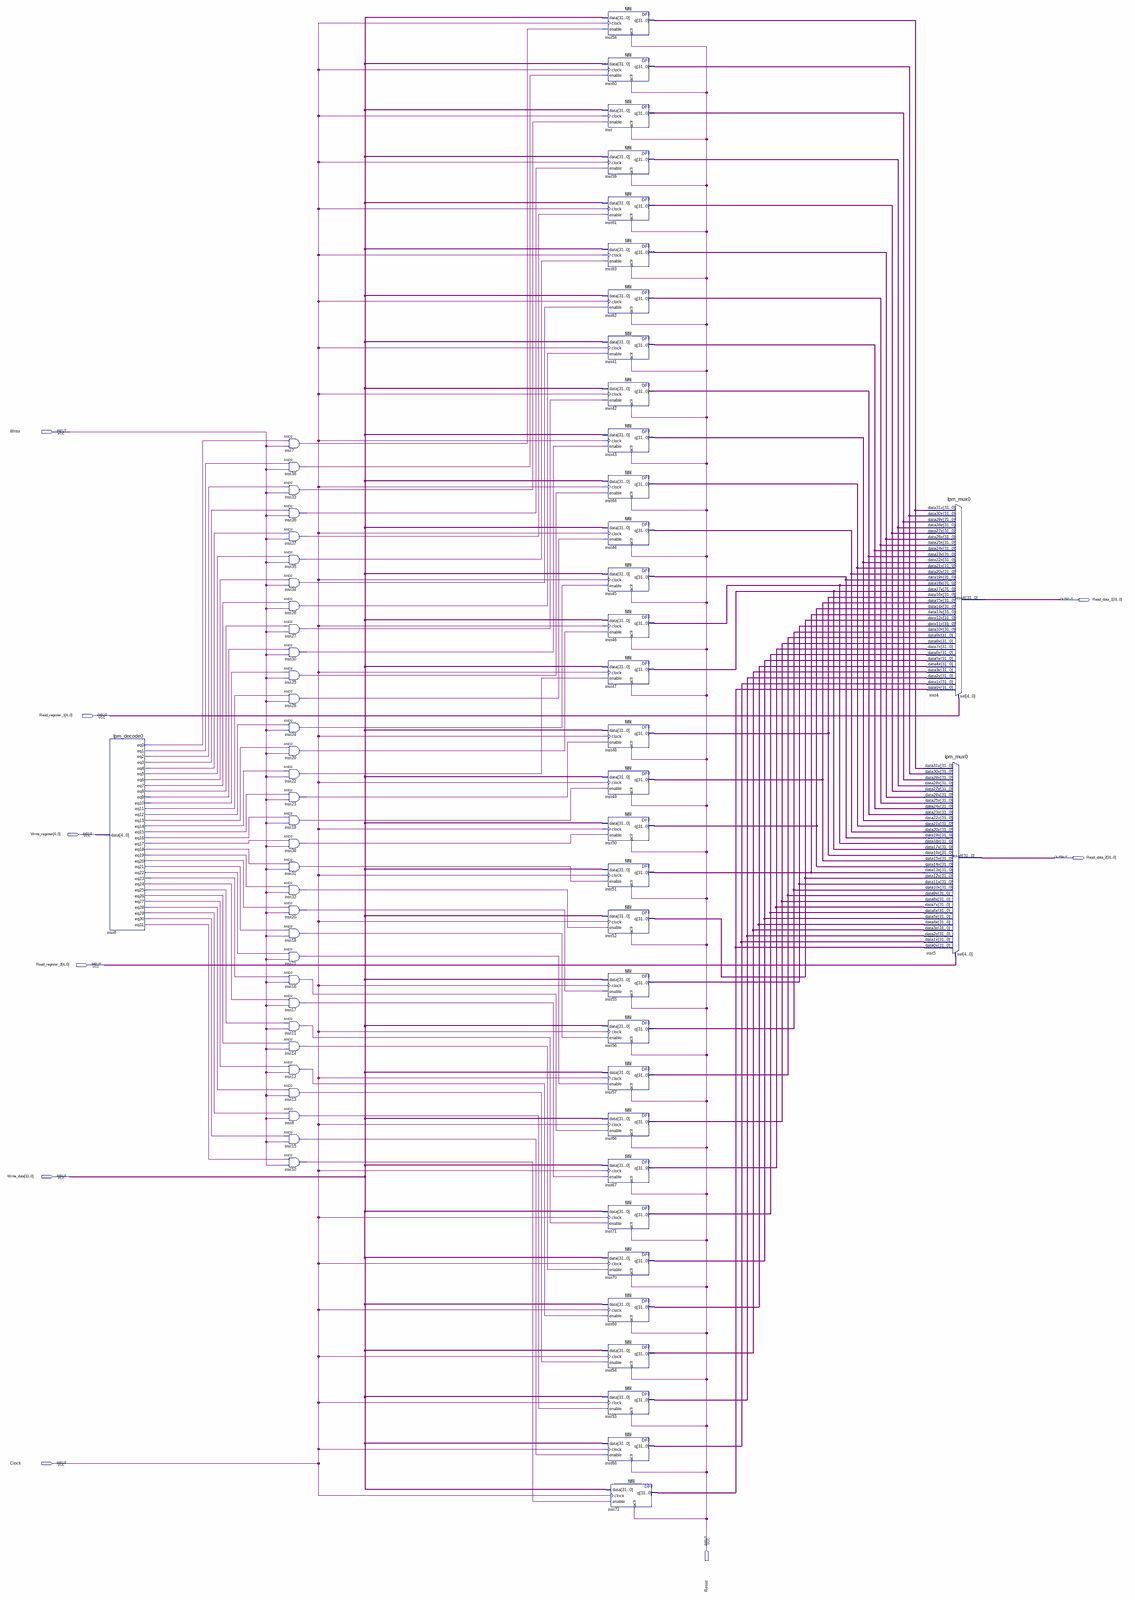
[diagram p0: schematic sheet, whole]
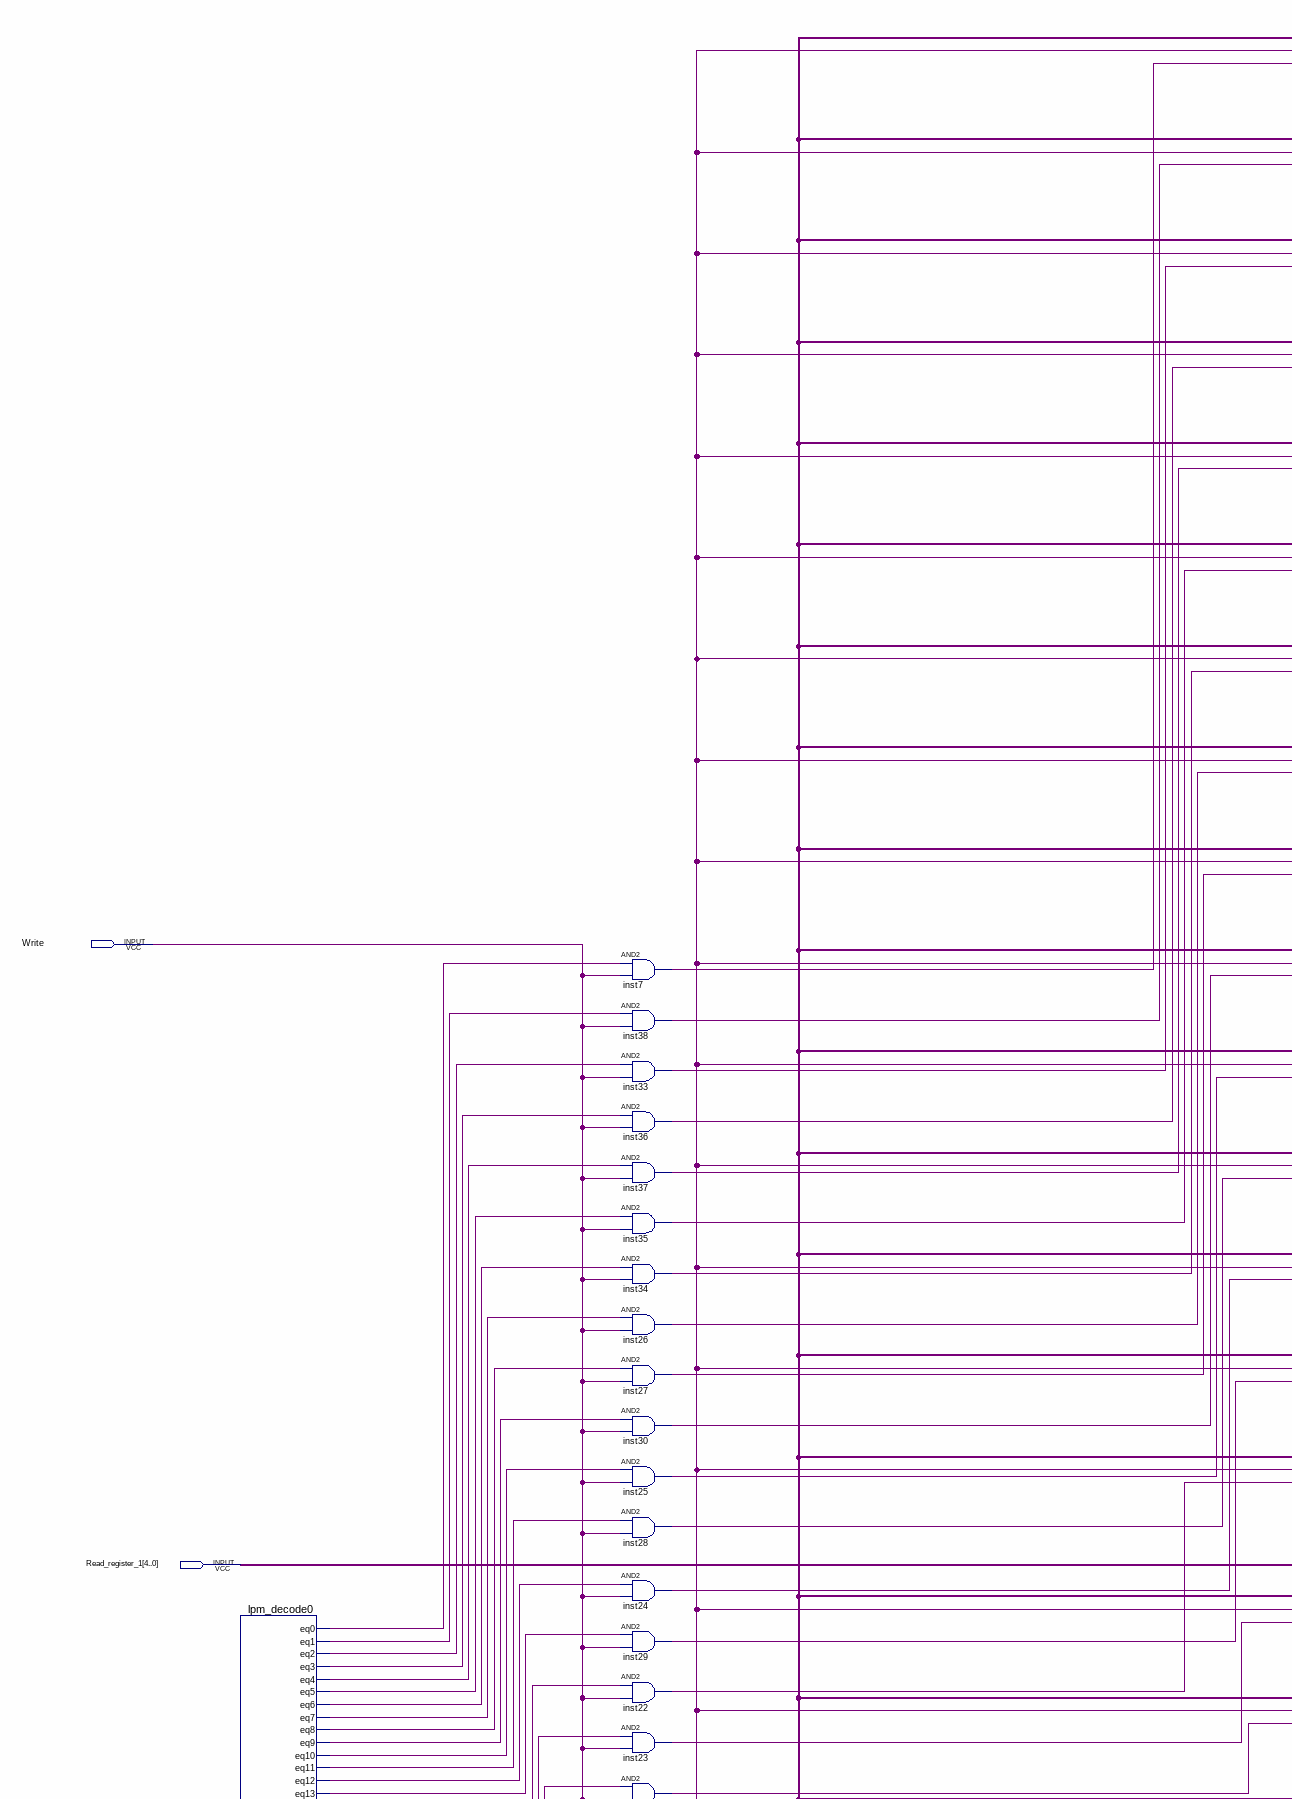
[diagram p1: schematic sheet, upper left part]
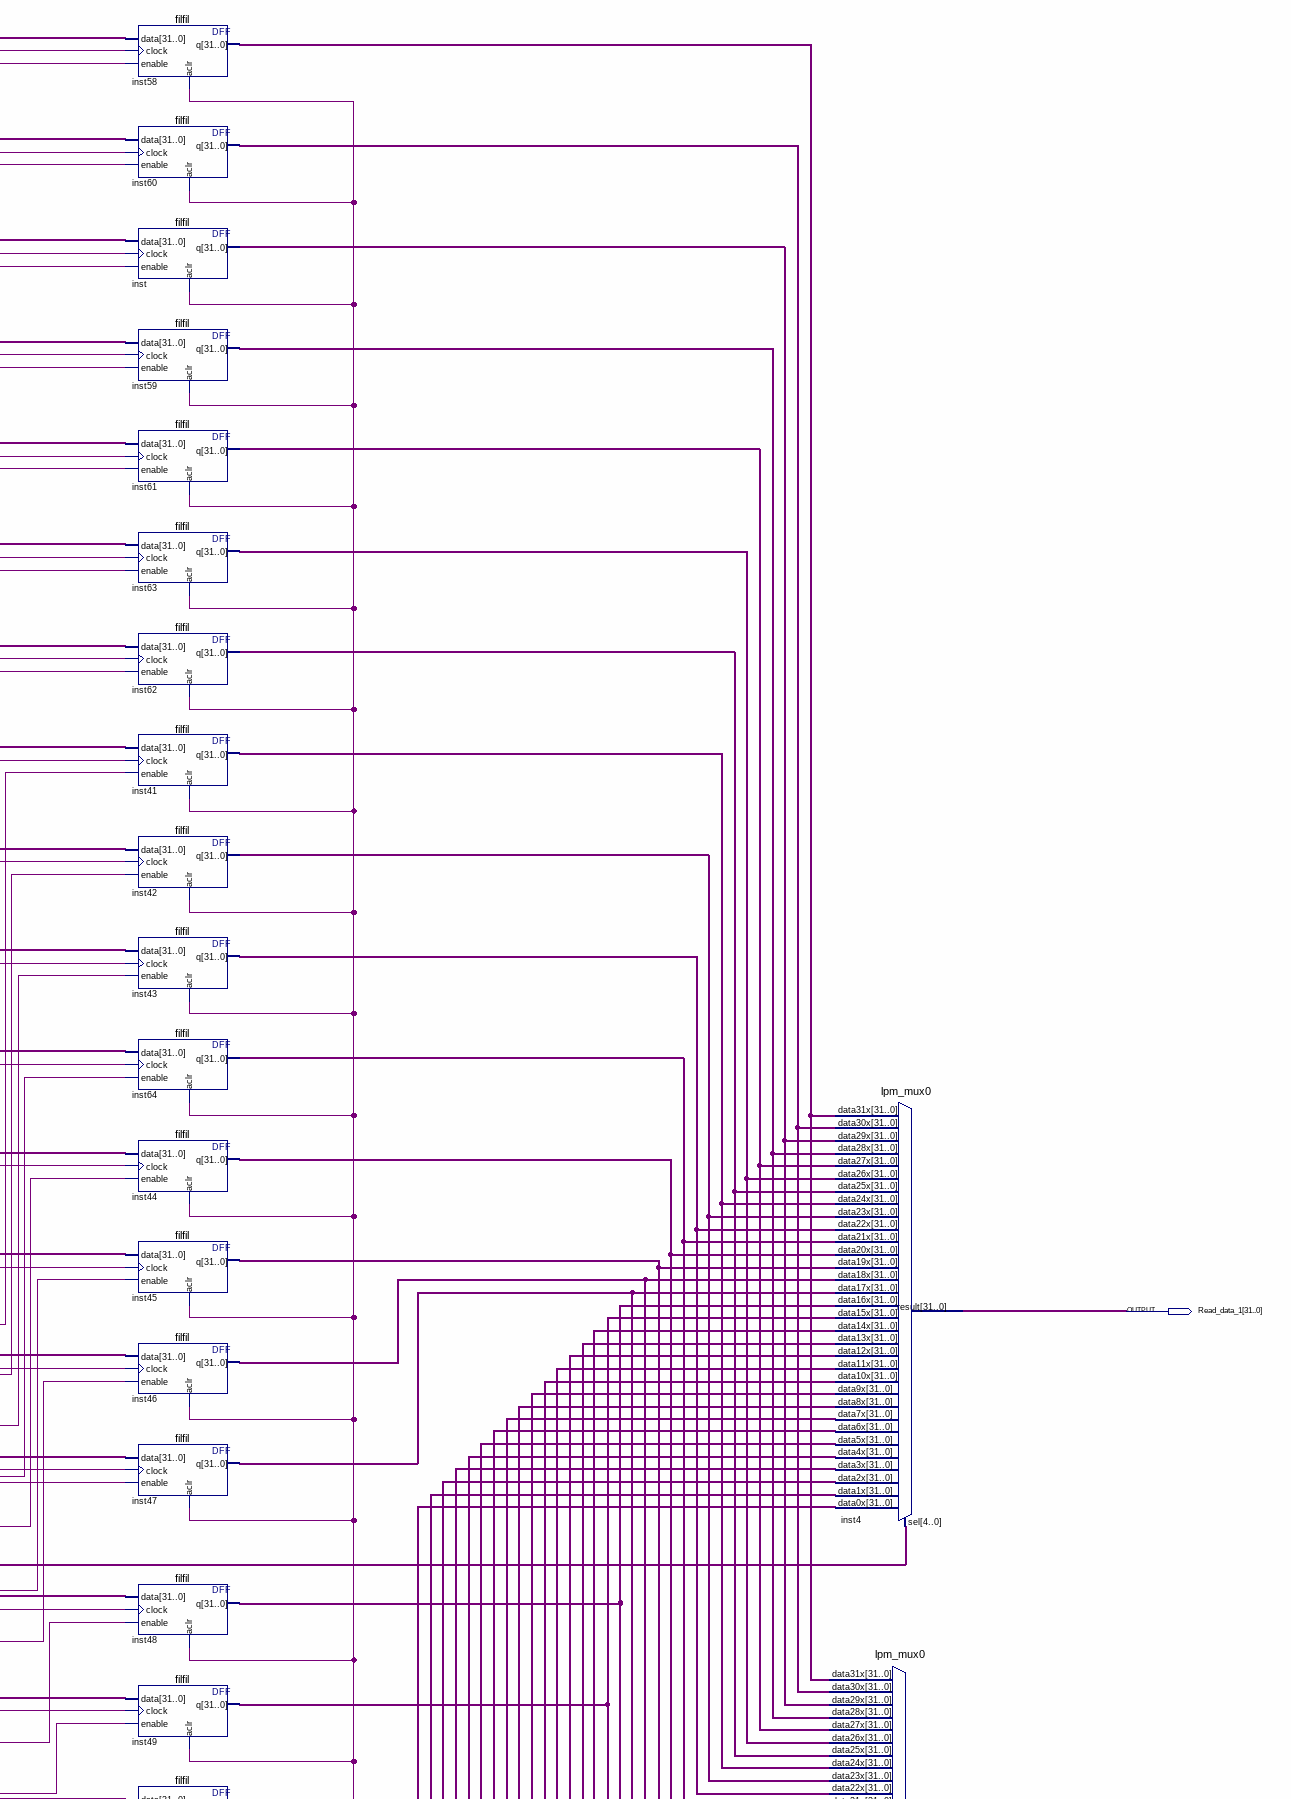
[diagram p2: schematic sheet, upper right part]
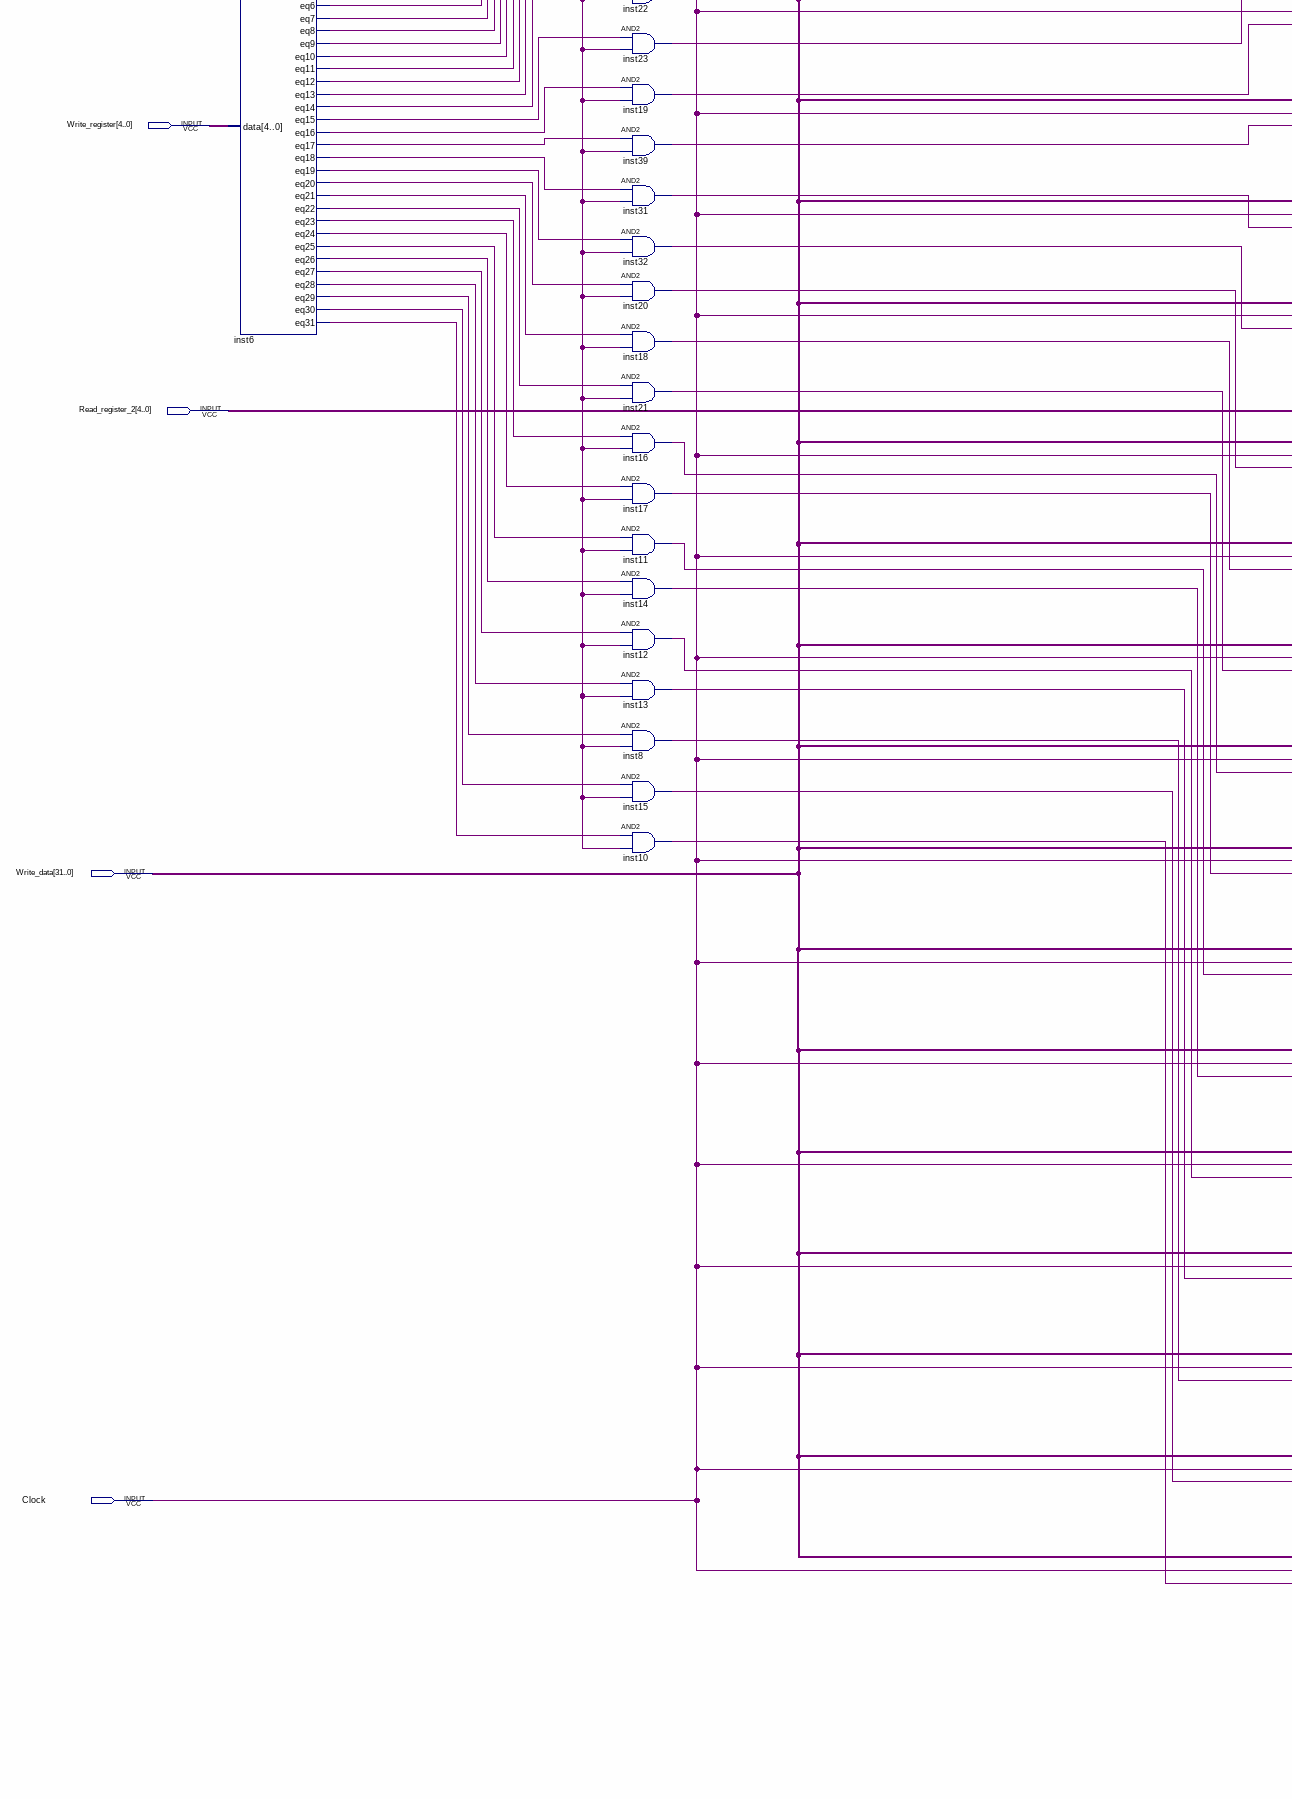
[diagram p3: schematic sheet, lower left part]
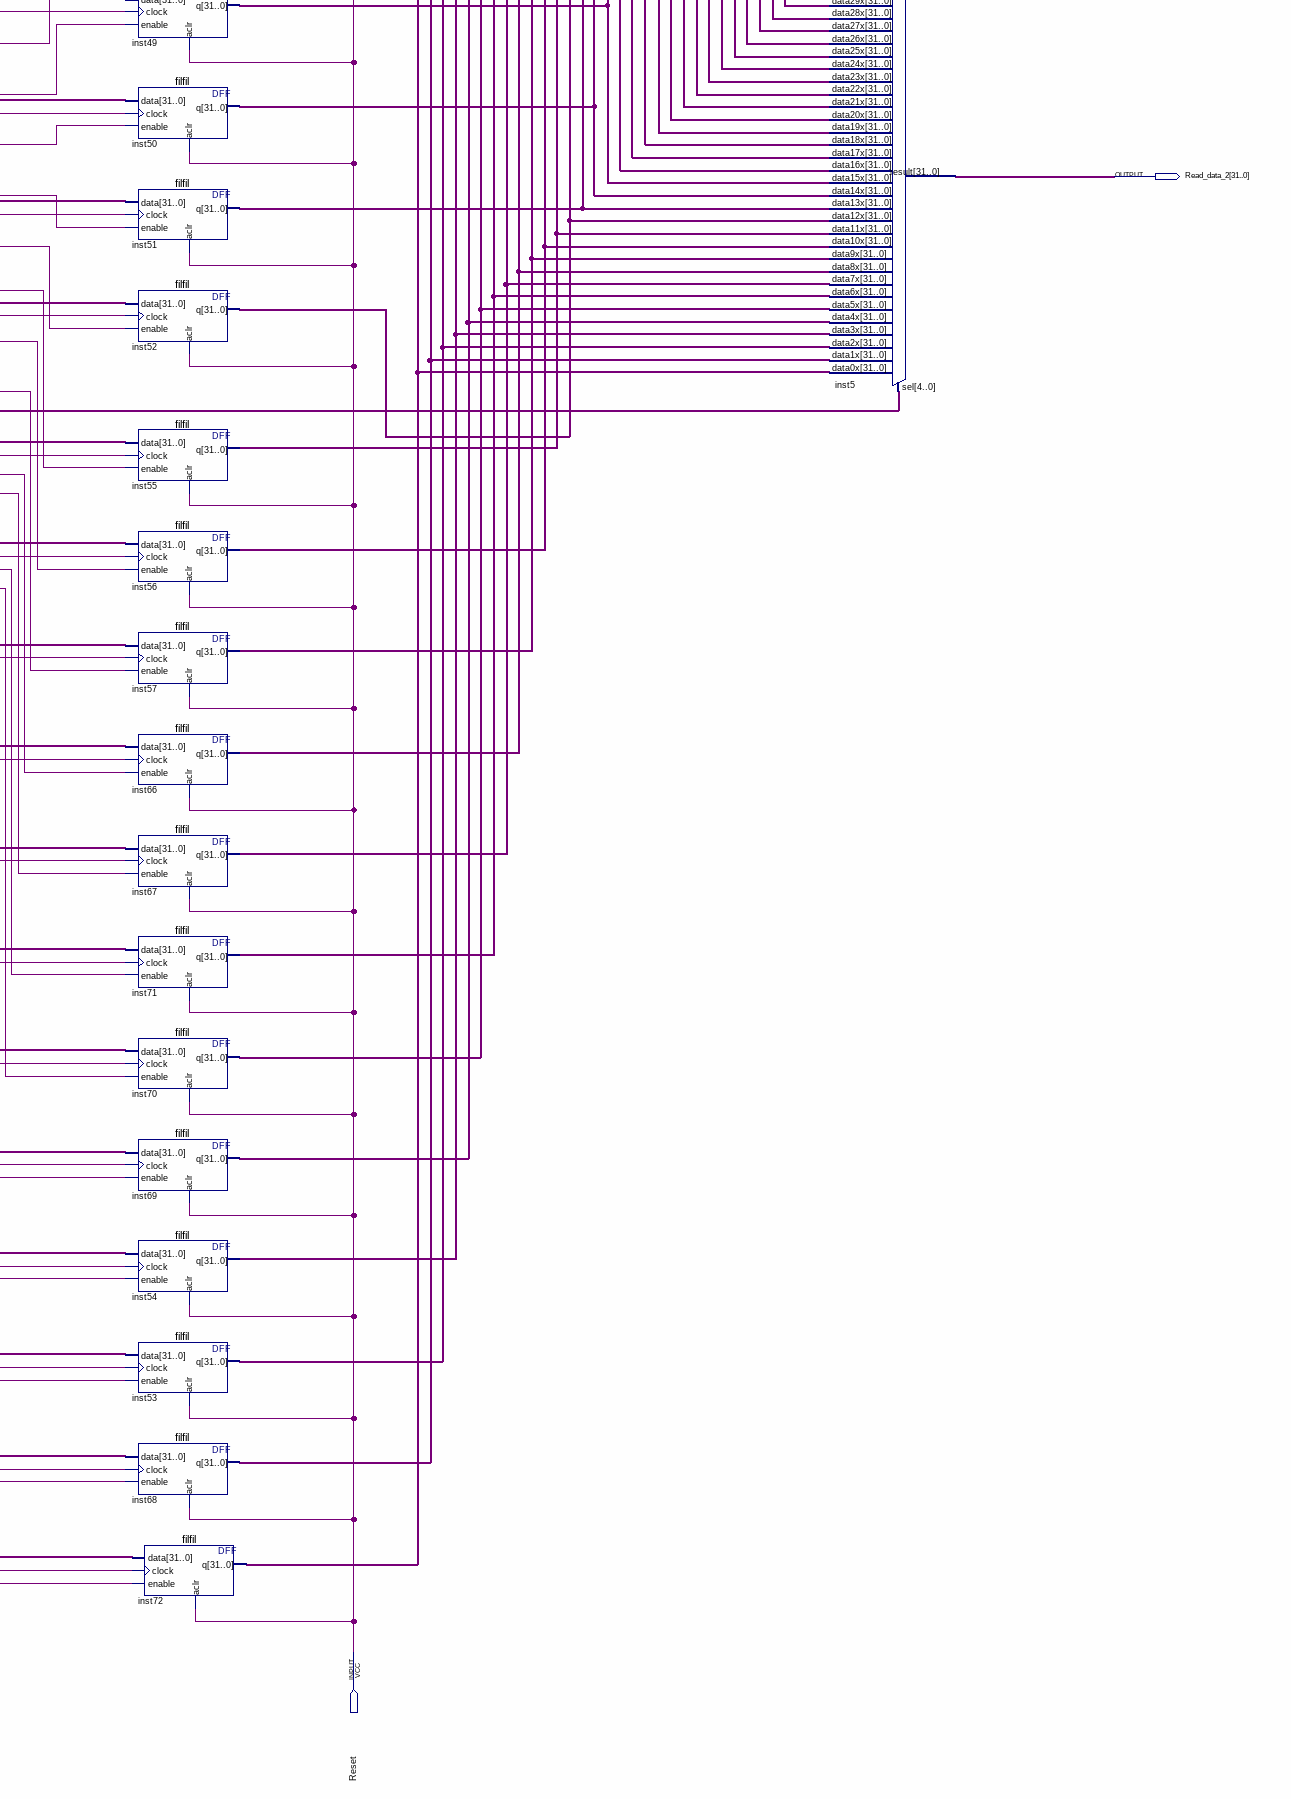
[diagram p4: schematic sheet, lower right part]
// Quartus schematic sarbazi-register.bdf as structural Verilog: 67 symbols, 9 pins
module \sarbazi-register  (
  input  Write,
  input  [4:0] Read_register_1,
  input  [4:0] Write_register,
  input  [4:0] Read_register_2,
  input  [31:0] Write_data,
  input  Clock,
  input  Reset,
  output [31:0] Read_data_1,
  output [31:0] Read_data_2
);

  wire inst6_eq0, inst6_eq1, inst6_eq2, inst6_eq3, inst6_eq4, inst6_eq5, inst6_eq6, inst6_eq7, inst6_eq8,
       inst6_eq9, inst6_eq10, inst6_eq11, inst6_eq12, inst6_eq13, inst6_eq14, inst6_eq15, inst6_eq16,
       inst6_eq17, inst6_eq18, inst6_eq19, inst6_eq20, inst6_eq21, inst6_eq22, inst6_eq23, inst6_eq24,
       inst6_eq25, inst6_eq26, inst6_eq27, inst6_eq28, inst6_eq29, inst6_eq30, inst6_eq31, inst7_out,
       inst8_out, inst10_out, inst11_out, inst12_out, inst13_out, inst14_out, inst15_out, inst16_out,
       inst17_out, inst18_out, inst19_out, inst20_out, inst21_out, inst22_out, inst23_out, inst24_out,
       inst25_out, inst26_out, inst27_out, inst28_out, inst29_out, inst30_out, inst31_out, inst32_out,
       inst33_out, inst34_out, inst35_out, inst36_out, inst37_out, inst38_out, inst39_out;
  wire [31:0] inst41_q, inst42_q, inst43_q, inst44_q, inst45_q, inst46_q, inst47_q, inst48_q, inst49_q,
       inst50_q, inst51_q, inst52_q, inst53_q, inst54_q, inst55_q, inst56_q, inst57_q, inst58_q, inst59_q,
       inst60_q, inst61_q, inst62_q, inst63_q, inst64_q, inst66_q, inst67_q, inst68_q, inst69_q, inst70_q,
       inst71_q, inst72_q, inst_q;

  lpm_decode0 inst6 (
    .data(Write_register), .eq0(inst6_eq0), .eq1(inst6_eq1), .eq2(inst6_eq2), .eq3(inst6_eq3),
    .eq4(inst6_eq4), .eq5(inst6_eq5), .eq6(inst6_eq6), .eq7(inst6_eq7), .eq8(inst6_eq8), .eq9(inst6_eq9),
    .eq10(inst6_eq10), .eq11(inst6_eq11), .eq12(inst6_eq12), .eq13(inst6_eq13), .eq14(inst6_eq14),
    .eq15(inst6_eq15), .eq16(inst6_eq16), .eq17(inst6_eq17), .eq18(inst6_eq18), .eq19(inst6_eq19),
    .eq20(inst6_eq20), .eq21(inst6_eq21), .eq22(inst6_eq22), .eq23(inst6_eq23), .eq24(inst6_eq24),
    .eq25(inst6_eq25), .eq26(inst6_eq26), .eq27(inst6_eq27), .eq28(inst6_eq28), .eq29(inst6_eq29),
    .eq30(inst6_eq30), .eq31(inst6_eq31));
  and inst7 (inst7_out, inst6_eq0, Write);
  and inst38 (inst38_out, inst6_eq1, Write);
  and inst33 (inst33_out, inst6_eq2, Write);
  and inst36 (inst36_out, inst6_eq3, Write);
  and inst37 (inst37_out, inst6_eq4, Write);
  and inst35 (inst35_out, inst6_eq5, Write);
  and inst34 (inst34_out, inst6_eq6, Write);
  and inst26 (inst26_out, inst6_eq7, Write);
  and inst27 (inst27_out, inst6_eq8, Write);
  and inst30 (inst30_out, inst6_eq9, Write);
  and inst25 (inst25_out, inst6_eq10, Write);
  and inst28 (inst28_out, inst6_eq11, Write);
  and inst24 (inst24_out, inst6_eq12, Write);
  and inst29 (inst29_out, inst6_eq13, Write);
  and inst22 (inst22_out, inst6_eq14, Write);
  and inst23 (inst23_out, inst6_eq15, Write);
  and inst19 (inst19_out, inst6_eq16, Write);
  and inst39 (inst39_out, inst6_eq17, Write);
  and inst31 (inst31_out, inst6_eq18, Write);
  and inst32 (inst32_out, inst6_eq19, Write);
  and inst20 (inst20_out, inst6_eq20, Write);
  and inst18 (inst18_out, inst6_eq21, Write);
  and inst21 (inst21_out, inst6_eq22, Write);
  and inst16 (inst16_out, inst6_eq23, Write);
  and inst17 (inst17_out, inst6_eq24, Write);
  and inst11 (inst11_out, inst6_eq25, Write);
  and inst14 (inst14_out, inst6_eq26, Write);
  and inst12 (inst12_out, inst6_eq27, Write);
  and inst13 (inst13_out, inst6_eq28, Write);
  and inst8 (inst8_out, inst6_eq29, Write);
  and inst15 (inst15_out, inst6_eq30, Write);
  and inst10 (inst10_out, inst6_eq31, Write);
  filfil inst58 (.data(Write_data), .clock(Clock), .enable(inst7_out), .aclr(Reset), .q(inst58_q));
  filfil inst60 (.data(Write_data), .clock(Clock), .enable(inst38_out), .aclr(Reset), .q(inst60_q));
  filfil inst (.data(Write_data), .clock(Clock), .enable(inst33_out), .aclr(Reset), .q(inst_q));
  filfil inst59 (.data(Write_data), .clock(Clock), .enable(inst36_out), .aclr(Reset), .q(inst59_q));
  filfil inst61 (.data(Write_data), .clock(Clock), .enable(inst37_out), .aclr(Reset), .q(inst61_q));
  filfil inst63 (.data(Write_data), .clock(Clock), .enable(inst35_out), .aclr(Reset), .q(inst63_q));
  filfil inst62 (.data(Write_data), .clock(Clock), .enable(inst34_out), .aclr(Reset), .q(inst62_q));
  filfil inst41 (.data(Write_data), .clock(Clock), .enable(inst26_out), .aclr(Reset), .q(inst41_q));
  filfil inst42 (.data(Write_data), .clock(Clock), .enable(inst27_out), .aclr(Reset), .q(inst42_q));
  filfil inst43 (.data(Write_data), .clock(Clock), .enable(inst30_out), .aclr(Reset), .q(inst43_q));
  filfil inst64 (.data(Write_data), .clock(Clock), .enable(inst25_out), .aclr(Reset), .q(inst64_q));
  filfil inst44 (.data(Write_data), .clock(Clock), .enable(inst28_out), .aclr(Reset), .q(inst44_q));
  filfil inst45 (.data(Write_data), .clock(Clock), .enable(inst24_out), .aclr(Reset), .q(inst45_q));
  filfil inst46 (.data(Write_data), .clock(Clock), .enable(inst29_out), .aclr(Reset), .q(inst46_q));
  filfil inst47 (.data(Write_data), .clock(Clock), .enable(inst22_out), .aclr(Reset), .q(inst47_q));
  filfil inst48 (.data(Write_data), .clock(Clock), .enable(inst23_out), .aclr(Reset), .q(inst48_q));
  filfil inst49 (.data(Write_data), .clock(Clock), .enable(inst19_out), .aclr(Reset), .q(inst49_q));
  filfil inst50 (.data(Write_data), .clock(Clock), .enable(inst39_out), .aclr(Reset), .q(inst50_q));
  filfil inst51 (.data(Write_data), .clock(Clock), .enable(inst31_out), .aclr(Reset), .q(inst51_q));
  filfil inst52 (.data(Write_data), .clock(Clock), .enable(inst32_out), .aclr(Reset), .q(inst52_q));
  filfil inst55 (.data(Write_data), .clock(Clock), .enable(inst20_out), .aclr(Reset), .q(inst55_q));
  filfil inst56 (.data(Write_data), .clock(Clock), .enable(inst18_out), .aclr(Reset), .q(inst56_q));
  filfil inst57 (.data(Write_data), .clock(Clock), .enable(inst21_out), .aclr(Reset), .q(inst57_q));
  filfil inst66 (.data(Write_data), .clock(Clock), .enable(inst16_out), .aclr(Reset), .q(inst66_q));
  filfil inst67 (.data(Write_data), .clock(Clock), .enable(inst17_out), .aclr(Reset), .q(inst67_q));
  filfil inst71 (.data(Write_data), .clock(Clock), .enable(inst11_out), .aclr(Reset), .q(inst71_q));
  filfil inst70 (.data(Write_data), .clock(Clock), .enable(inst14_out), .aclr(Reset), .q(inst70_q));
  filfil inst69 (.data(Write_data), .clock(Clock), .enable(inst12_out), .aclr(Reset), .q(inst69_q));
  filfil inst54 (.data(Write_data), .clock(Clock), .enable(inst13_out), .aclr(Reset), .q(inst54_q));
  filfil inst53 (.data(Write_data), .clock(Clock), .enable(inst8_out), .aclr(Reset), .q(inst53_q));
  filfil inst68 (.data(Write_data), .clock(Clock), .enable(inst15_out), .aclr(Reset), .q(inst68_q));
  filfil inst72 (.data(Write_data), .clock(Clock), .enable(inst10_out), .aclr(Reset), .q(inst72_q));
  lpm_mux0 inst4 (
    .data31x(inst58_q), .data30x(inst60_q), .data29x(inst_q), .data28x(inst59_q), .data27x(inst61_q),
    .data26x(inst63_q), .data25x(inst62_q), .data24x(inst41_q), .data23x(inst42_q), .data22x(inst43_q),
    .data21x(inst64_q), .data20x(inst44_q), .data19x(inst45_q), .data18x(inst46_q), .data17x(inst47_q),
    .data16x(inst48_q), .data15x(inst49_q), .data14x(inst50_q), .data13x(inst51_q), .data12x(inst52_q),
    .data11x(inst55_q), .data10x(inst56_q), .data9x(inst57_q), .data8x(inst66_q), .data7x(inst67_q),
    .data6x(inst71_q), .data5x(inst70_q), .data4x(inst69_q), .data3x(inst54_q), .data2x(inst53_q),
    .data1x(inst68_q), .data0x(inst72_q), .sel(Read_register_1), .result(Read_data_1));
  lpm_mux0 inst5 (
    .data31x(inst58_q), .data30x(inst60_q), .data29x(inst_q), .data28x(inst59_q), .data27x(inst61_q),
    .data26x(inst63_q), .data25x(inst62_q), .data24x(inst41_q), .data23x(inst42_q), .data22x(inst43_q),
    .data21x(inst64_q), .data20x(inst44_q), .data19x(inst45_q), .data18x(inst46_q), .data17x(inst47_q),
    .data16x(inst48_q), .data15x(inst49_q), .data14x(inst50_q), .data13x(inst51_q), .data12x(inst52_q),
    .data11x(inst55_q), .data10x(inst56_q), .data9x(inst57_q), .data8x(inst66_q), .data7x(inst67_q),
    .data6x(inst71_q), .data5x(inst70_q), .data4x(inst69_q), .data3x(inst54_q), .data2x(inst53_q),
    .data1x(inst68_q), .data0x(inst72_q), .sel(Read_register_2), .result(Read_data_2));
endmodule
